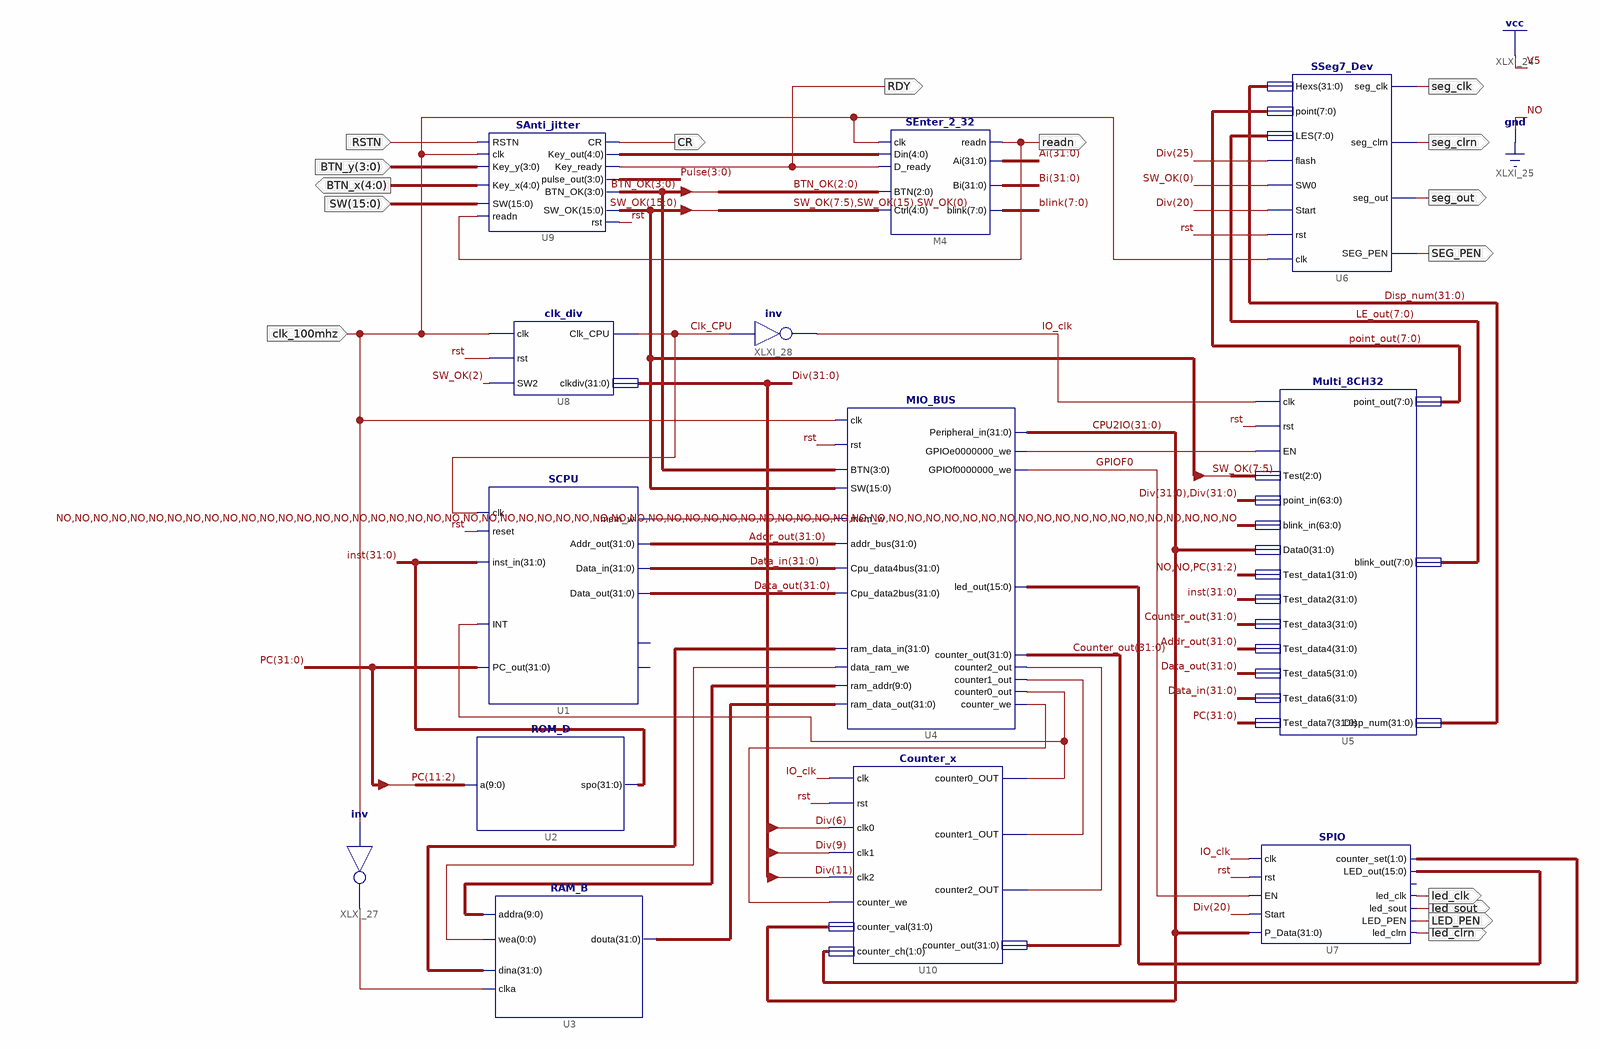
[diagram p0: schematic sheet 1]
// Xilinx ISE schematic top.sch (kintex7) as structural Verilog: 13 symbols, 16 ports
module top (
  input  [3:0] BTN_y,
  input  [15:0] SW,
  input  RSTN,
  input  clk_100mhz,
  output CR,
  output RDY,
  output [4:0] BTN_x,
  output readn,
  output seg_clk,
  output seg_clrn,
  output seg_out,
  output SEG_PEN,
  output led_clk,
  output led_sout,
  output led_clrn,
  output LED_PEN
);

  wire Clk_CPU, GPIOF0, IO_clk, rst, XLXN_7, XLXN_16, XLXN_17, XLXN_18, XLXN_19, XLXN_99, XLXN_147;
  wire [0:0] XLXN_10;
  wire [1:0] XLXN_80;
  wire [3:0] BTN_OK, Pulse;
  wire [4:0] XLXN_30;
  wire [7:0] blink, LE_out, point_out;
  wire [9:0] XLXN_214;
  wire [15:0] SW_OK, XLXN_122;
  wire [31:0] Addr_out, Ai, Bi, Counter_out, CPU2IO, Data_in, Data_out, Disp_num, Div, inst, PC, XLXN_13,
       XLXN_14;

  MIO_BUS U4 (
    .rst(rst), .clk(clk_100mhz), .mem_w(XLXN_7), .addr_bus(Addr_out), .Cpu_data4bus(Data_in),
    .Cpu_data2bus(Data_out), .ram_data_out(XLXN_14), .ram_addr(XLXN_214), .data_ram_we(XLXN_10[0]),
    .ram_data_in(XLXN_13), .counter_out(Counter_out), .counter2_out(XLXN_16), .counter1_out(XLXN_17),
    .counter0_out(XLXN_18), .counter_we(XLXN_19), .BTN(BTN_OK), .SW(SW_OK), .led_out(XLXN_122),
    .Peripheral_in(CPU2IO), .GPIOe0000000_we(XLXN_99), .GPIOf0000000_we(GPIOF0));
  SAnti_jitter U9 (
    .SW(SW), .readn(readn), .Key_y(BTN_y), .Key_x(BTN_x), .RSTN(RSTN), .clk(clk_100mhz), .Key_out(XLXN_30),
    .Key_ready(RDY), .CR(CR), .rst(rst), .SW_OK(SW_OK), .pulse_out(Pulse), .BTN_OK(BTN_OK));
  SEnter_2_32 M4 (
    .readn(readn), .Ai(Ai), .Bi(Bi), .blink(blink), .Din(XLXN_30), .D_ready(RDY), .clk(clk_100mhz),
    .Ctrl({SW_OK[7:5], SW_OK[15], SW_OK[0]}), .BTN(BTN_OK[2:0]));
  clk_div U8 (.clk(clk_100mhz), .rst(rst), .SW2(SW_OK[2]), .Clk_CPU(Clk_CPU), .clkdiv(Div));
  Counter_x U10 (
    .clk(IO_clk), .rst(rst), .clk0(Div[6]), .clk1(Div[9]), .clk2(Div[11]), .counter_we(XLXN_19),
    .counter_val(CPU2IO), .counter_ch(XLXN_80), .counter0_OUT(XLXN_18), .counter1_OUT(XLXN_17),
    .counter2_OUT(XLXN_16), .counter_out(Counter_out));
  Multi_8CH32 U5 (
    .clk(IO_clk), .rst(rst), .EN(XLXN_99), .Test(SW_OK[7:5]), .point_in({Div, Div}), .blink_in({64{1'b0}}),
    .Data0(CPU2IO), .Test_data1({2'b00, PC[31:2]}), .Test_data2(inst), .Test_data3(Counter_out),
    .Test_data4(Addr_out), .Test_data5(Data_out), .Test_data6(Data_in), .Test_data7(PC),
    .point_out(point_out), .blink_out(LE_out), .Disp_num(Disp_num));
  SSeg7_Dev U6 (
    .Hexs(Disp_num), .point(point_out), .LES(LE_out), .flash(Div[25]), .SW0(SW_OK[0]), .Start(Div[20]),
    .rst(rst), .clk(clk_100mhz), .seg_clk(seg_clk), .seg_clrn(seg_clrn), .seg_out(seg_out), .SEG_PEN(SEG_PEN));
  not XLXI_27 (XLXN_147, clk_100mhz);
  not XLXI_28 (IO_clk, Clk_CPU);
  SPIO U7 (
    .clk(IO_clk), .rst(rst), .EN(GPIOF0), .Start(Div[20]), .P_Data(CPU2IO), .led_clk(led_clk),
    .led_sout(led_sout), .LED_PEN(LED_PEN), .led_clrn(led_clrn), .counter_set(XLXN_80), .LED_out(XLXN_122));  // open: GPIOf0
  RAM_B U3 (.addra(XLXN_214), .clka(XLXN_147), .wea(XLXN_10[0]), .dina(XLXN_13), .douta(XLXN_14));
  ROM_D U2 (.a(PC[11:2]), .spo(inst));
  SCPU U1 (
    .clk(Clk_CPU), .reset(rst), .inst_in(inst), .INT(XLXN_18), .Addr_out(Addr_out), .mem_w(XLXN_7),
    .Data_out(Data_out), .Data_in(Data_in), .PC_out(PC));  // open: CPU_MIO, MIO_ready
endmodule
